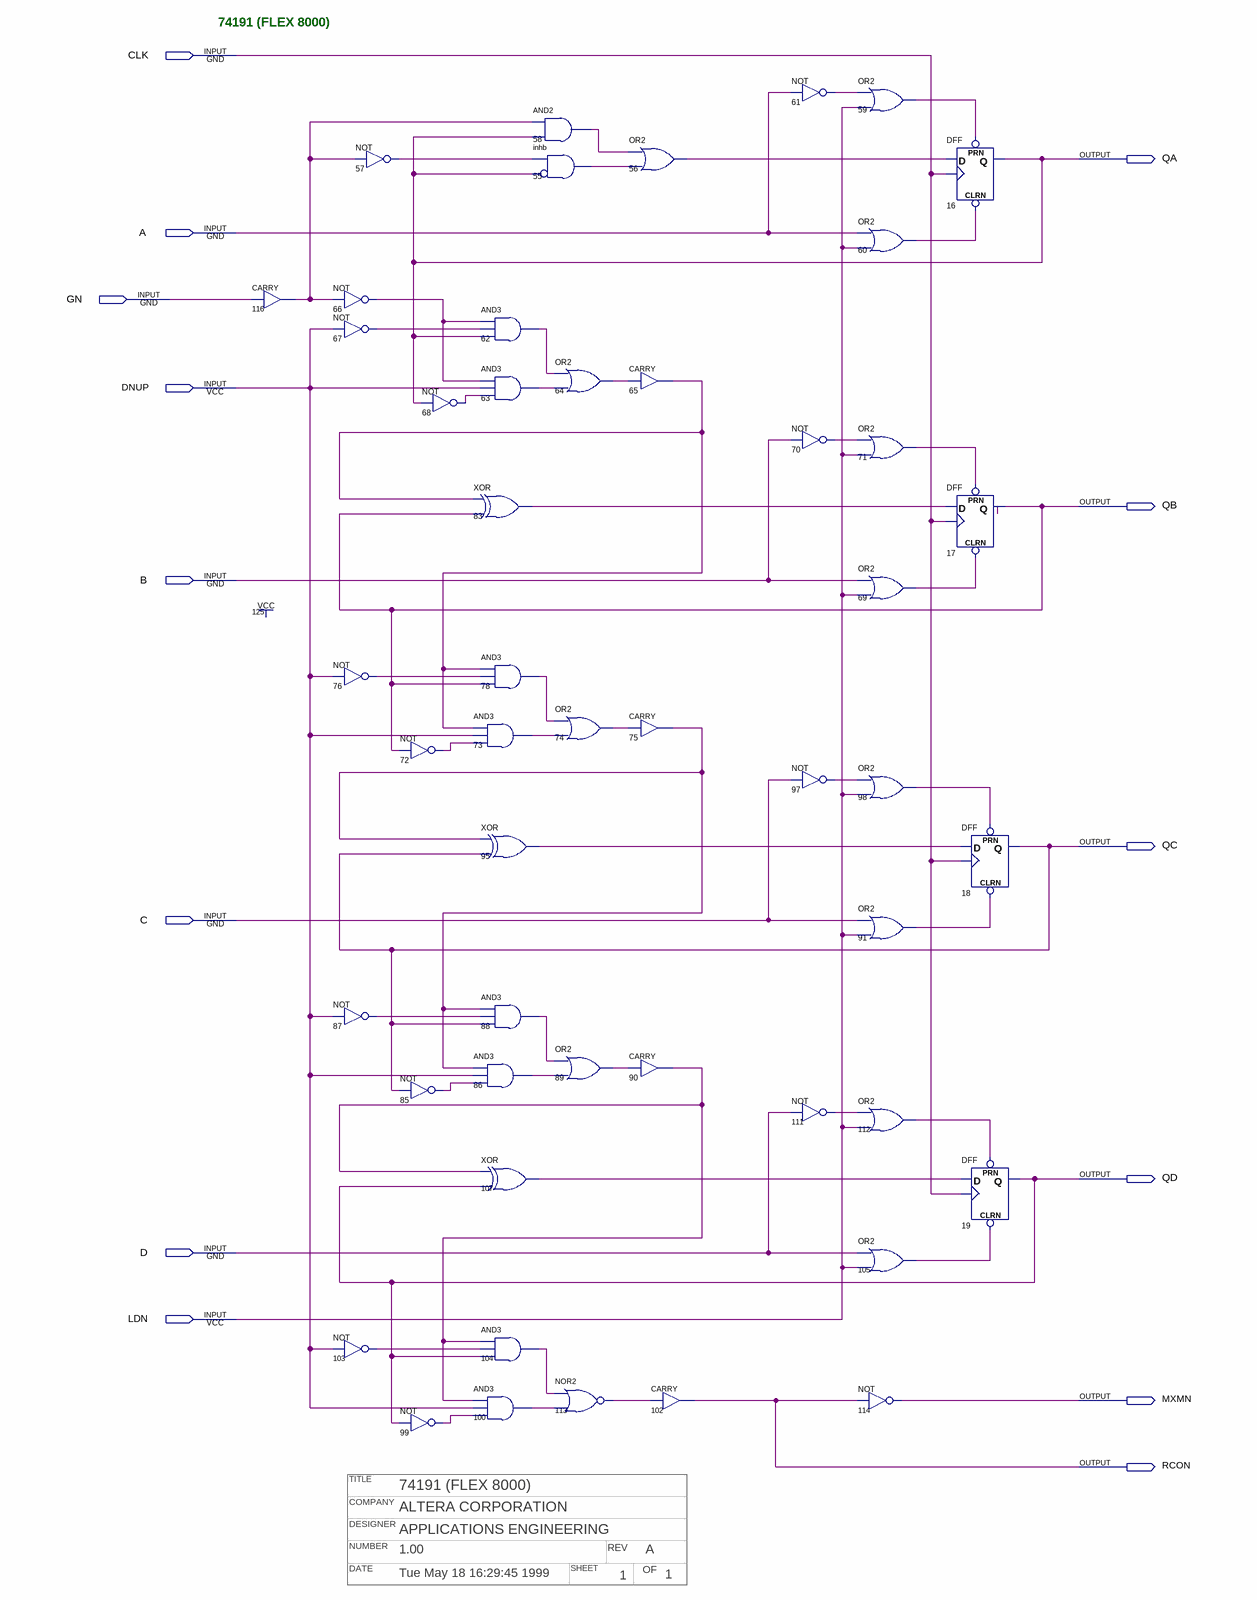
[diagram p0: schematic sheet]
// Quartus schematic f74191.bdf as structural Verilog: 50 symbols, 14 pins
// Title block: TITLE: 74191 (FLEX 8000); COMPANY: ALTERA CORPORATION; DESIGNER: APPLICATIONS ENGINEERING; NUMBER: 1.00; REV: A; DATE: Tue May 18 16:29:45 1999; SHEET: 1; OF: 1
module f74191 (
  input  CLK,
  input  A,
  input  GN,
  input  DNUP,
  input  B,
  input  C,
  input  D,
  input  LDN,
  output QA,
  output QB,
  output QC,
  output QD,
  output MXMN,
  output RCON
);

  wire n55_1, n56_out, n57_out, n58_out, n59_out, n60_out, n61_out, n62_out, n63_out, n64_out, n65_out,
       n66_out, n67_out, n68_out, n69_out, n70_out, n71_out, n72_out, n73_out, n74_out, n75_out, n76_out,
       n78_out, n83_out, n85_out, n86_out, n87_out, n88_out, n89_out, n90_out, n91_out, n95_out, n97_out,
       n98_out, n99_out, n100_out, n103_out, n104_out, n105_out, n107_out, n111_out, n112_out, n113_out,
       n116_out;

  CARRY u_116 (.IN(GN), .OUT(n116_out));
  not u_57 (n57_out, n116_out);
  not u_66 (n66_out, n116_out);
  not u_67 (n67_out, DNUP);
  not u_76 (n76_out, DNUP);
  not u_87 (n87_out, DNUP);
  not u_103 (n103_out, DNUP);
  not u_72 (n72_out, QB);
  not u_85 (n85_out, QC);
  not u_99 (n99_out, QD);
  not u_68 (n68_out, QA);
  xor u_83 (n83_out, n65_out, QB);
  and u_73 (n73_out, n65_out, DNUP, n72_out);
  and u_86 (n86_out, n75_out, DNUP, n85_out);
  and u_100 (n100_out, n90_out, DNUP, n99_out);
  and u_58 (n58_out, n116_out, QA);
  inhb u_55 (.\2 (n57_out), .\3 (QA), .\1 (n55_1));
  and u_62 (n62_out, n66_out, n67_out, QA);
  and u_63 (n63_out, n66_out, DNUP, n68_out);
  and u_78 (n78_out, n65_out, n76_out, QB);
  xor u_95 (n95_out, n75_out, QC);
  and u_88 (n88_out, n75_out, n87_out, QC);
  xor u_107 (n107_out, n90_out, QD);
  and u_104 (n104_out, n90_out, n103_out, QD);
  or u_64 (n64_out, n62_out, n63_out);
  or u_74 (n74_out, n78_out, n73_out);
  or u_89 (n89_out, n88_out, n86_out);
  nor u_113 (n113_out, n104_out, n100_out);
  or u_56 (n56_out, n58_out, n55_1);
  CARRY u_65 (.IN(n64_out), .OUT(n65_out));
  CARRY u_75 (.IN(n74_out), .OUT(n75_out));
  CARRY u_90 (.IN(n89_out), .OUT(n90_out));
  CARRY u_102 (.IN(n113_out), .OUT(RCON));
  not u_61 (n61_out, A);
  not u_70 (n70_out, B);
  not u_97 (n97_out, C);
  not u_111 (n111_out, D);
  or u_59 (n59_out, n61_out, LDN);
  or u_60 (n60_out, A, LDN);
  or u_71 (n71_out, n70_out, LDN);
  or u_69 (n69_out, B, LDN);
  or u_98 (n98_out, n97_out, LDN);
  or u_91 (n91_out, C, LDN);
  or u_112 (n112_out, n111_out, LDN);
  or u_105 (n105_out, D, LDN);
  not u_114 (MXMN, RCON);
  DFF u_16 (.CLRN(n60_out), .CLK(CLK), .D(n56_out), .PRN(n59_out), .Q(QA));
  DFF u_17 (.CLRN(n69_out), .CLK(CLK), .D(n83_out), .PRN(n71_out), .Q(QB));
  DFF u_18 (.CLRN(n91_out), .CLK(CLK), .D(n95_out), .PRN(n98_out), .Q(QC));
  DFF u_19 (.CLRN(n105_out), .CLK(CLK), .D(n107_out), .PRN(n112_out), .Q(QD));

  // Notes on the sheet:
  //   74191 (FLEX 8000)
endmodule
